# Altium schematic sheet SHOW.SchDoc
size A3
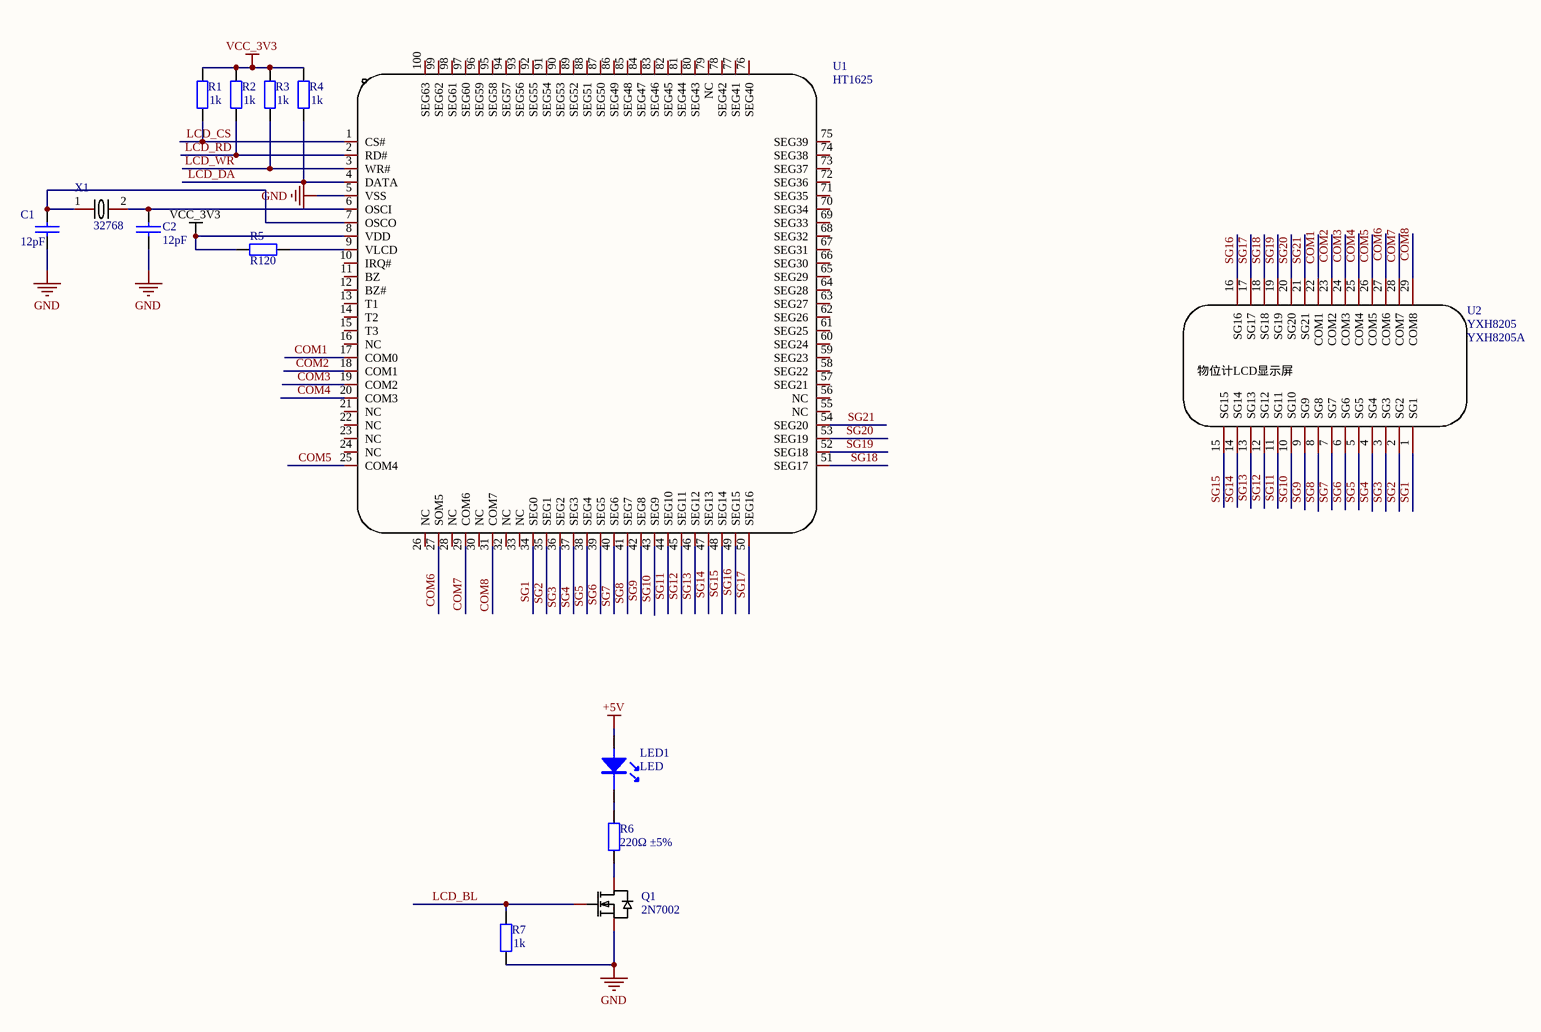
[diagram p0: SHOW.SchDoc]

## Parts
C1  12pF  [C-0805]
C2  12pF  [C-0805]
LED1  LED  [LED0805-R-RD]
Q1  2N7002  [SOT-23-3]
R1  1k  [R-0805]
R2  1k  [R-0805]
R3  1k  [R-0805]
R4  1k  [R-0805]
R5  R120  [R-0805]
R6  220Ω ±5%  [R-0805]
R7  1k  [R-0805]
U1  HT1625  [LQFP-100_L14.0-W14.0-P0.50-LS16.0-BL - duplicate]
U2  YXH8205  [YXH8205A]
X1  32768  [CRYSTAL-SMD_L3.2-W1.5]

## Nets
+5V: LED1.1
GND: C1.1 C2.1 Q1.2(S) R7.1 U1.5(VSS)
VCC_3V3: R1.2 R2.2 R3.2 R4.2 R5.2 U1.8(VDD)
COM1: U1.17(COM0) U2.22(COM1)
COM2: U1.18(COM1) U2.23(COM2)
COM3: U1.19(COM2) U2.24(COM3)
COM4: U1.20(COM3) U2.25(COM4)
COM5: U1.25(COM4) U2.26(COM5)
COM6: U1.27(SOM5) U2.27(COM6)
COM7: U1.29(COM6) U2.28(COM7)
COM8: U1.31(COM7) U2.29(COM8)
LCD_BL: Q1.1(G) R7.2
LCD_CS: R1.1 U1.1(CS#)
LCD_DA: R4.1 U1.4(DATA)
LCD_RD: R2.1 U1.2(RD#)
LCD_WR: R3.1 U1.3(WR#)
SG1: U1.34(SEG0) U2.1(SG1)
SG2: U1.35(SEG1) U2.2(SG2)
SG3: U1.36(SEG2) U2.3(SG3)
SG4: U1.37(SEG3) U2.4(SG4)
SG5: U1.38(SEG4) U2.5(SG5)
SG6: U1.39(SEG5) U2.6(SG6)
SG7: U1.40(SEG6) U2.7(SG7)
SG8: U1.41(SEG7) U2.8(SG8)
SG9: U1.42(SEG8) U2.9(SG9)
SG10: U1.43(SEG9) U2.10(SG10)
SG11: U1.44(SEG10) U2.11(SG11)
SG12: U1.45(SEG11) U2.12(SG12)
SG13: U1.46(SEG12) U2.13(SG13)
SG14: U1.47(SEG13) U2.14(SG14)
SG15: U1.48(SEG14) U2.15(SG15)
SG16: U1.49(SEG15) U2.16(SG16)
SG17: U1.50(SEG16) U2.17(SG17)
SG18: U1.51(SEG17) U2.18(SG18)
SG19: U1.52(SEG18) U2.19(SG19)
SG20: U1.53(SEG19) U2.20(SG20)
SG21: U1.54(SEG20) U2.21(SG21)
NetC1_2: C1.2 U1.7(OSCO) X1.1
NetC2_2: C2.2 U1.6(OSCI) X1.2
NetLED1_2: LED1.2 R6.2
NetQ1_3: Q1.3(D) R6.1
NetR5_1: R5.1 U1.9(VLCD)

Not connected (* = marked no-connect by the designer): U1 10(IRQ#) 11(BZ) 12(BZ#) 13(T1) 14(T2) 15(T3) 16(NC) 21(NC) 22(NC) 23(NC) 24(NC) 26(NC) 28(NC) 30(NC) 32(NC) 33(NC) 55(NC) 56(NC) 57(SEG21) 58(SEG22) 59(SEG23) 60(SEG24) 61(SEG25) 62(SEG26) 63(SEG27) 64(SEG28) 65(SEG29) 66(SEG30) 67(SEG31) 68(SEG32) 69(SEG33) 70(SEG34) 71(SEG35) 72(SEG36) 73(SEG37) 74(SEG38) 75(SEG39) 76(SEG40) 77(SEG41) 78(SEG42) 79(NC) 80(SEG43) 81(SEG44) 82(SEG45) 83(SEG46) 84(SEG47) 85(SEG48) 86(SEG49) 87(SEG50) 88(SEG51) 89(SEG52) 90(SEG53) 91(SEG54) 92(SEG55) 93(SEG56) 94(SEG57) 95(SEG58) 96(SEG59) 97(SEG60) 98(SEG61) 99(SEG62) 100(SEG63)

## Notes on the sheet
- (in symbol YXH8205A) 物位计LCD显示屏

## Library data of the parts
C1 C2 = C普通电容: 电容
Q1 = 2N7002_C8545: 阈值电压(Vgs(th)@Id):2.5V250μA;连续漏极电流(Id):115mA;漏源电压(Vdss):60V;类型:N沟道;导通电阻(RDS(on)@Vgs,Id):7.5Ω500mA,10V;功率(Pd):200mW;; Manufacturer: CJ（江苏长电/长晶）; Add into BOM: yes; Continuous Drain Current (Id): 115mA; Drain Source Voltage (Vdss): 60V; Type: N沟道; Power Dissipation (Pd): 200mW; Name: 2N7002; Symbol: 2N7002; Device: 2N7002_C8545; LCSC Part Name: 2N70027002; Supplier Part: C8545; Manufacturer Part: 2N7002; Supplier Footprint: SOT-23(SOT-23-3); JLCPCB Part Class: BasicPart; Datasheet: https://atta.szlcsc.com/upload/public/pdf/source/20170302/1488422688078.pdf; Supplier: LCSC; Convert to PCB: yes; Gate Threshold Voltage (Vgs(th)@Id): 2.5V250μA; Drain Source On Resistance (RDS(on)@Vgs,Id): 7.5Ω500mA,10V
R1-R7 = RES: 电阻; Value: 5.1K; Published: 8-Jun-2000; LatestRevisionDate: 17-Jul-2002; LatestRevisionNote: Re-released for DXP Platform.; PackageReference: AXIAL-0.4; Publisher: Altium Limited
U2 = YXH8205A: Add into BOM: yes; Name: YXH8205; Symbol: YXH8205A; Device: YXH8205A; Convert to PCB: yes
X1 = 7N032768NW2